# Altium schematic sheet layout.SchDoc
size A4; SheetNumber: 1; SheetTotal: 2
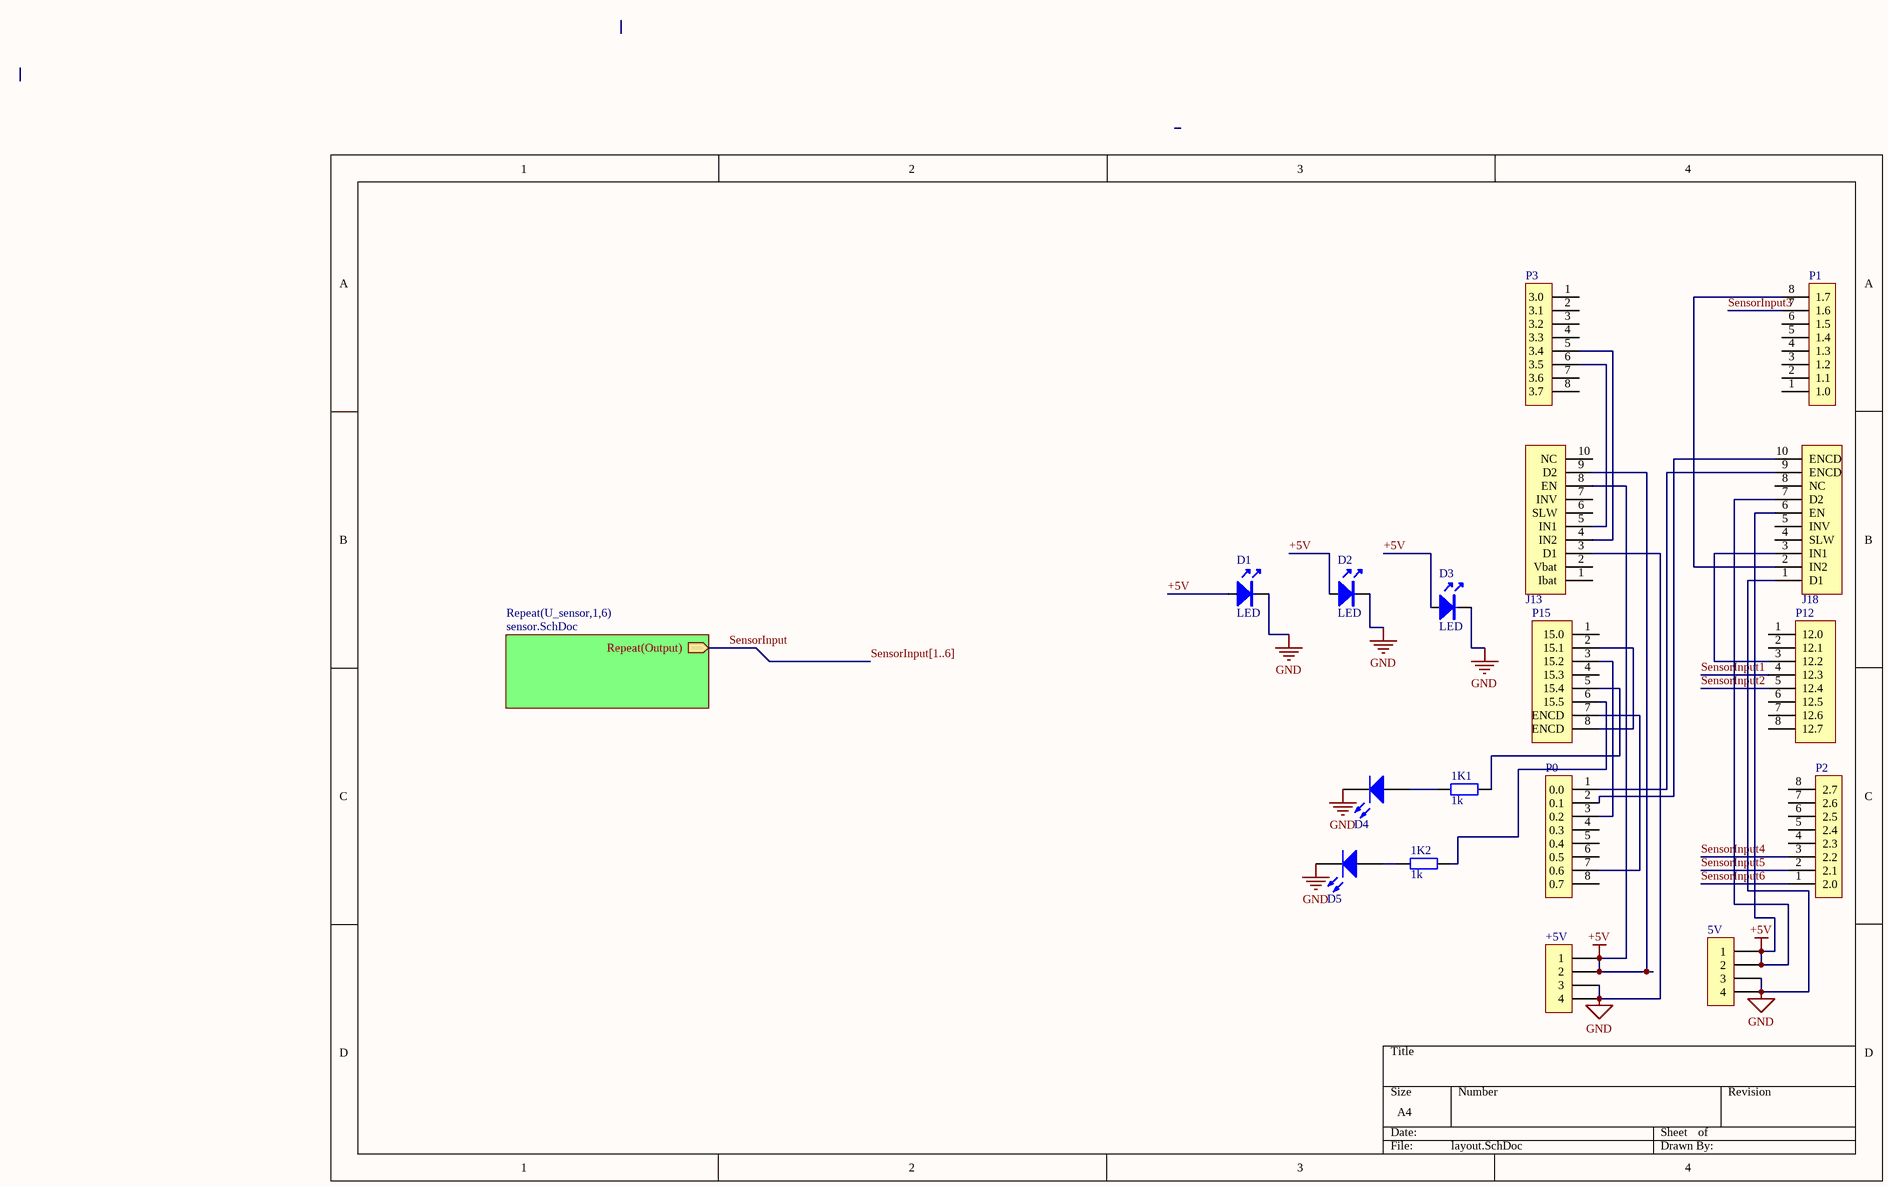
[diagram p0: layout.SchDoc]

## Parts
1K1  1k  [0805 RES]
1K2  1k  [0805 RES]
5V  5V  [IDC4]  (value not drawn)
+5V  5V  [IDC4]  (value not drawn)
D1  LED  [LED0.1/5MM]
D2  LED  [LED0.1/5MM]
D3  LED  [LED0.1/5MM]
D4  LTST-C170KGKT  [0805 LED]  (value not drawn)
D5  LTST-C170KGKT  [0805 LED]  (value not drawn)
J13  CON10  [idc10]  (value not drawn)
J18  CON10  [IDC10]  (value not drawn)
P0  P0  [idc8]  (value not drawn)
P1  P1  [idc8]  (value not drawn)
P2  P2  [idc8]  (value not drawn)
P3  P3  [idc8]  (value not drawn)
P12  P12  [idc8]  (value not drawn)
P15  P15  [idc8]  (value not drawn)

## Sub-sheets
Repeat(U_sensor,1,6) = sensor.SchDoc: Repeat(Output) (out)

## Nets
+5V: 5V.1 5V.2 +5V.1 +5V.2 D1.A D2.A D3.A J13.8(EN) J13.9(D2) J18.6(EN) J18.7(D2)
GND: 5V.3 5V.4 +5V.3 +5V.4 D1.K D2.K D3.K D4.2(K) D5.2(K) J13.3(D1) J18.1(D1)
SensorInput: sheet Repeat(U_sensor,1,6)/Repeat(Output)
SensorInput1: P12.4(12.3)
SensorInput2: P12.5(12.4)
SensorInput3: P1.7(1.6)
SensorInput4: P2.3(2.2)
SensorInput5: P2.2(2.1)
SensorInput6: P2.1(2.0)
Net1K1_1: 1K1.1 D4.1(A)
Net1K1_2: 1K1.2 P15.5(15.4)
Net1K2_1: 1K2.1 D5.1(A)
Net1K2_2: 1K2.2 P15.6(15.5)
NetJ13_4: J13.4(IN2) P3.5(3.4)
NetJ13_5: J13.5(IN1) P3.6(3.5)
NetJ18_2: J18.2(IN2) P1.8(1.7)
NetJ18_3: J18.3(IN1) P12.3(12.2)
NetJ18_9: J18.9(ENCD) P0.1(0.0)
NetJ18_10: J18.10(ENCD) P0.2(0.1)
NetP0_3: P0.3(0.2) P15.3(15.2)
NetP0_7: P0.7(0.6) P15.7(ENCD)
NetP15_2: P15.2(15.1) P15.8(ENCD)

Not connected (* = marked no-connect by the designer): J13 1(Ibat) 2(Vbat) 6(SLW) 7(INV) 10(NC); J18 4(SLW) 5(INV) 8(NC); P0 4(0.3) 5(0.4) 6(0.5) 8(0.7); P1 1(1.0) 2(1.1) 3(1.2) 4(1.3) 5(1.4) 6(1.5); P2 4(2.3) 5(2.4) 6(2.5) 7(2.6) 8(2.7); P3 1(3.0) 2(3.1) 3(3.2) 4(3.3) 7(3.6) 8(3.7); P12 1(12.0) 2(12.1) 6(12.5) 7(12.6) 8(12.7); P15 1(15.0) 4(15.3)

## Buses and harness runs
bus SensorInput[1..6]

## Library data of the parts
1K1 1K2 = Res_SMT_0805: 0805 resistor; Published: 8-Jun-2000; LatestRevisionDate: 17-Jul-2002; LatestRevisionNote: Re-released for DXP Platform.; PackageReference: AXIAL-0.4; Publisher: Altium Limited; Value: 1k; ComponentLink1Description: https://nz.mouser.com/datasheet/2/315/AOA0000C304-1149620.pdf
5V +5V = CON4: Connector
D4 D5 = LED_SMT_0805: SMT LED 0805 size; Manufacturer: Lite-On Inc.; Color: Green; Lens Color: Colorless; Lens Transparency: Clear; Millicandela Rating: 35mcd; Lens Style/Size: Rectangle with Flat Top, 1.40mm x 1.25mm; Voltage - Forward (Vf) (Typ): 2V; Current - Test: 20mA; Viewing Angle: 130°; Wavelength - Dominant: 571nm; Wavelength - Peak: 574nm; Supplier 1: Digi-Key; Manufacturer Part Number: LTST-C170KGKT; RoHS: RoHS Compliant; Category: Optoelectronics; Stock 1: 503069; Pricing 1: 1=0.62, 10=0.459, 25=0.338, 100=0.2415, 250=0.16416, 500=0.14486, 1000=0.11347 (NZD); Packaging: Cut Tape (CT); Part Status: Active; Mounting Type: Surface Mount; Features: -; Package / Case: 0805 (2012 Metric); Size / Dimension: 2.00mm L x 1.25mm W; Height (Max): 1.10mm; ComponentLink1URL: http://optoelectronics.liteon.com/upload/download/DS22-2000-073/LTST-C170KGKT.pdf; ComponentLink1Description: http://optoelectronics.liteon.com/upload/download/DS22-2000-073/LTST-C170KGKT.pdf; Supplier Part Number 1: 160-1414-1-ND
J13 J18 = CON10: Connector
P0-P3 = CON8: Connector
P12 P15 = CON8_1: Connector